# EAGLE design sky293 (EAGLE 4.09)
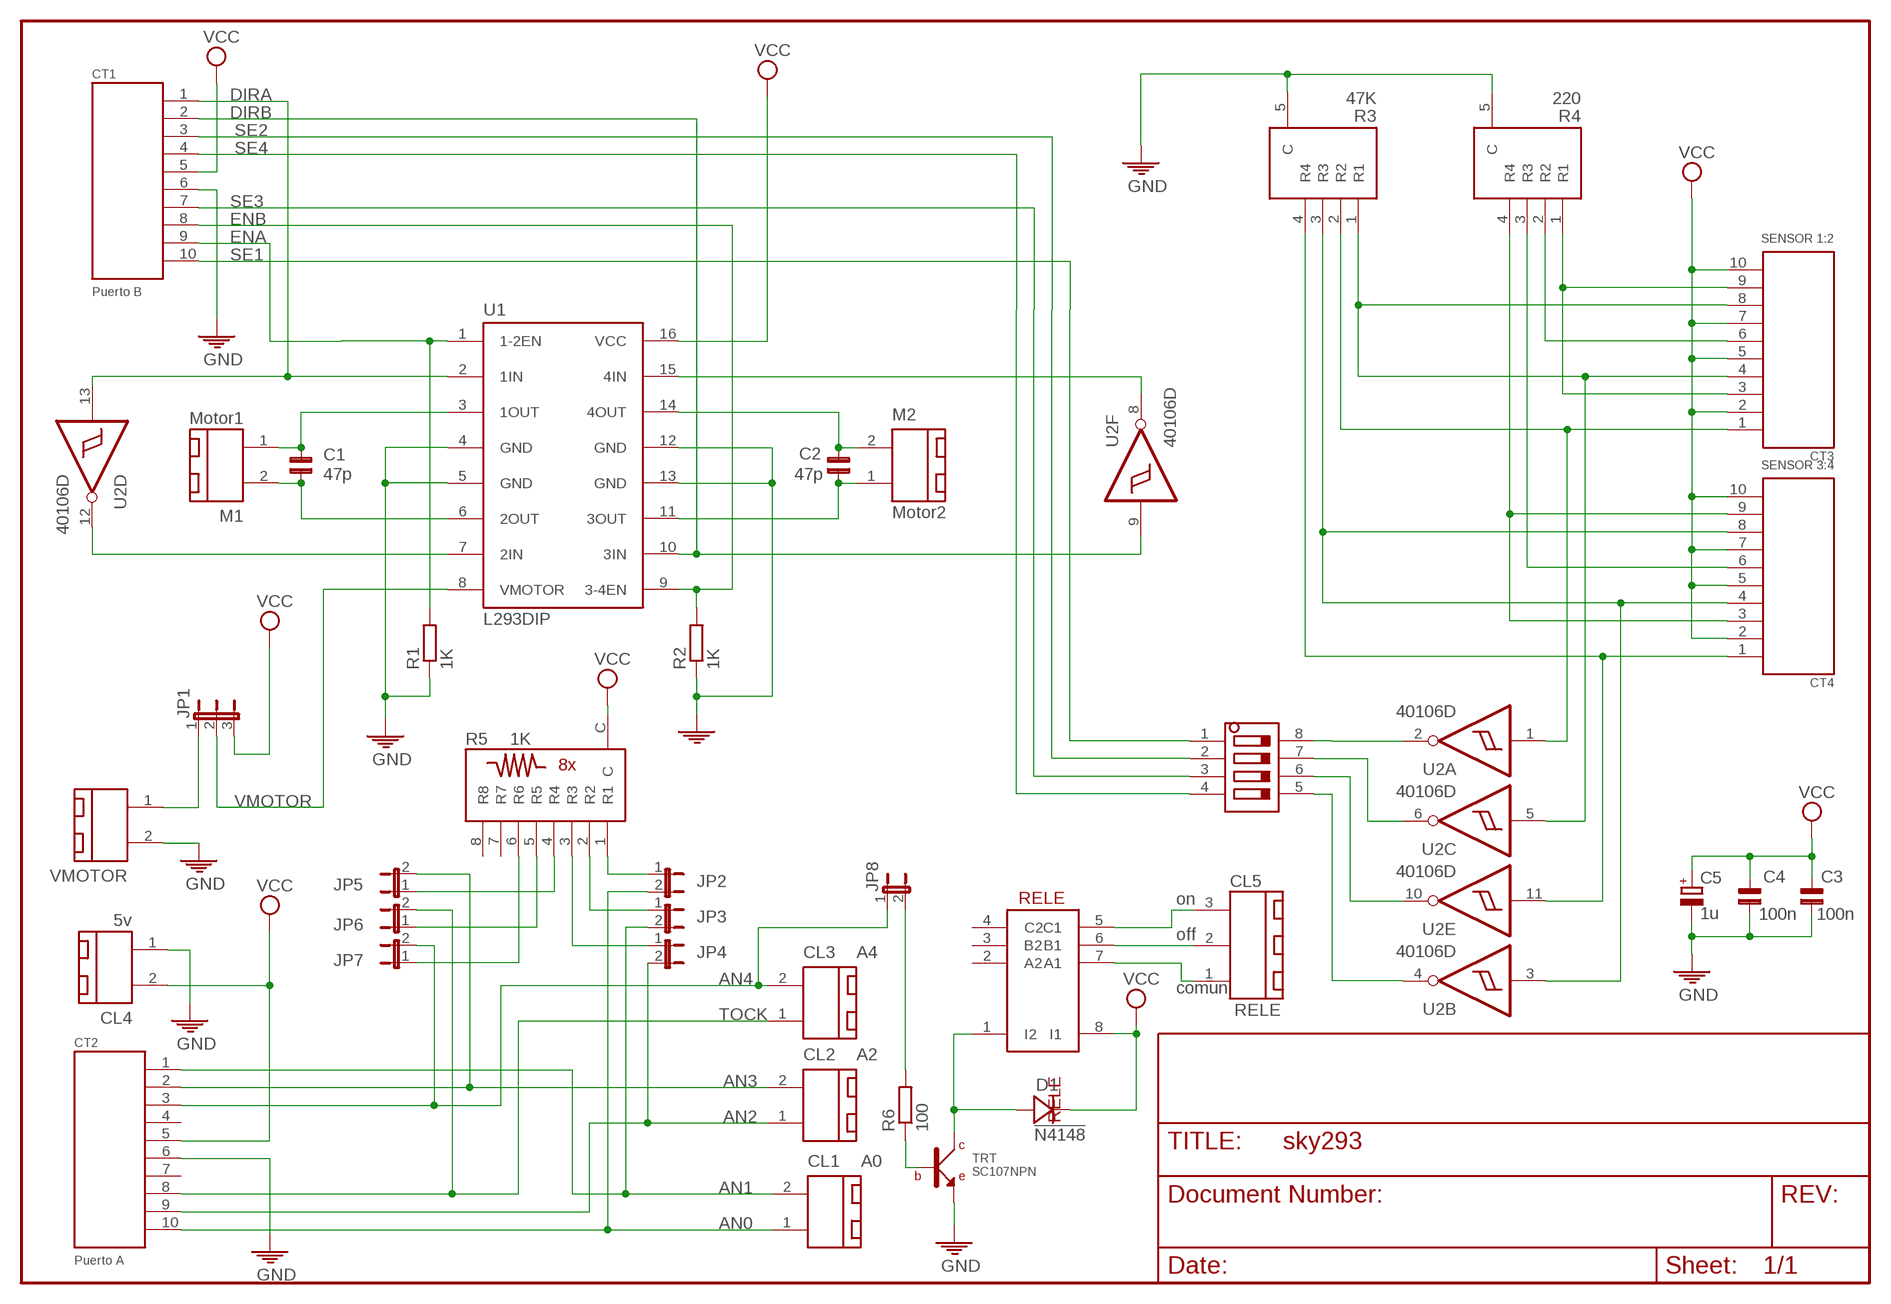
[diagram p0: schematic, sheet 1]

## Parts
C1  47p  CON-MUL5  [C5]
C2  47p  CON-MUL5  [C5]
C3  100n  CON-MUL5  [C5]
C4  100n  CON-MUL5  [C5]
C5  1u  CPOL-EUTT2D6  [TT2D6]
CL1  A0  CLEMA2P  [C2P]
CL2  A2  CLEMA2P  [C2P]
CL3  A4  CLEMA2P  [C2P]
CL4  5v  CLEMA2P  [C2P]
CL5  RELE  CLEMA3P  [C3P]
CT1  Puerto B  CTCONA  [CTCON]
CT2  Puerto A  CTCONA  [CTCON]
CT3  SENSOR 1:2  CTCONA  [CTCON]
CT4  SENSOR 3:4  CTCONA  [CTCON]
D1  !N4148  1N4148  [DIODO]
JP1  JUMPER3R  [JP3R]
JP2  JUMPER2JPR2  [JPR2]
JP3  JUMPER2JPR2  [JPR2]
JP4  JUMPER2JPR2  [JPR2]
JP5  JUMPER2JPR2  [JPR2]
JP6  JUMPER2JPR2  [JPR2]
JP7  JUMPER2JPR2  [JPR2]
JP8  JUMPER2R  [JP2]
M1  Motor1  CLEMA2P  [C2P]
M2  Motor2  CLEMA2P  [C2P]
R1  1K  RESISTENCIA10  [R207/10]
R2  1K  RESISTENCIA10  [R207/10]
R3  47K  ARRAY4  [ARRAY4]
R4  220  ARRAY4  [ARRAY4]
R5  4K7  ARRAY8  [RED8]
R6  100  RESISTENCIA10  [R207/10]
RELE  RELE  [RELE]
TRT  SC107NPN  [TRT-NPN]
U1  L293DIP  [DIL16]
U2  40106D  [DIL14]
U$1  SWITCH4  [SWITCH4]
VMOTOR  CLEMA2P  [C2P]

## Nets
AN0: CL1.1 CT2.10 JP2.2
AN1: CL1.2 CT2.1 JP3.2
AN2: CL2.1 CT2.9 JP4.2
AN3: CL2.2 CT2.2 JP5.2
AN4: CL3.2 CT2.3 JP7.2 JP8.1
DIRA: CT1.1 U1.2(1IN) U2.13(D:I)
DIRB: CT1.2 U1.10(3IN) U2.9(F:I)
ENA: CT1.9 R1.2 U1.1(1-2EN)
ENB: CT1.8 R2.2 U1.9(3-4EN)
GND: C3.1 C4.1 C5.- CL4.1 CT1.6 CT2.6 R1.1 R2.1 R3.5(C) R4.5(C) TRT.E U1.4(GND) U1.5(GND) U1.12(GND) U1.13(GND) VMOTOR.2
N$1: C1.2 M1.1 U1.3(1OUT)
N$2: C1.1 M1.2 U1.6(2OUT)
N$3: C2.2 M2.2 U1.14(4OUT)
N$4: CT3.3 CT3.9 R4.1(R1)
N$5: U2.2(A:O) U$1.8
N$6: U1.7(2IN) U2.12(D:O)
N$7: CT3.6 R4.2(R2)
N$8: U1.15(4IN) U2.8(F:O)
N$9: C2.1 M2.1 U1.11(3OUT)
N$10: JP2.1 R5.1(R1)
N$11: U2.6(C:O) U$1.7
N$12: CT4.3 CT4.9 R4.4(R4)
N$13: U2.10(E:O) U$1.6
N$14: JP1.1 VMOTOR.1
N$15: JP3.1 R5.2(R2)
N$16: U2.4(B:O) U$1.5
N$17: JP4.1 R5.3(R3)
N$18: CT4.6 R4.3(R3)
N$19: CT3.4 CT3.8 R3.1(R1) U2.5(C:I)
N$20: JP5.1 R5.4(R4)
N$21: JP6.1 R5.5(R5)
N$22: CT3.1 R3.2(R2) U2.1(A:I)
N$23: JP7.1 R5.6(R6)
N$24: R6.1 TRT.B
N$25: CL5.3 RELE.5(C1)
N$26: CT4.4 CT4.8 R3.3(R3) U2.3(B:I)
N$27: CL5.2 RELE.6(B1)
N$28: CT4.1 R3.4(R4) U2.11(E:I)
N$29: CL5.1 RELE.7(A1)
N$30: JP8.2 R6.2
N$31: D1.A RELE.1(I2) TRT.C
SE1: CT1.10 U$1.1
SE2: CT1.3 U$1.2
SE3: CT1.7 U$1.3
SE4: CT1.4 U$1.4
TOCK: CL3.1 CT2.8 JP6.2
VCC: C3.2 C4.2 C5.+ CL4.2 CT1.5 CT2.5 CT3.2 CT3.5 CT3.7 CT3.10 CT4.2 CT4.5 CT4.7 CT4.10 D1.K(C) JP1.3 R5.C RELE.8(I1) U1.16(VCC)
VMOTOR: JP1.2 U1.8(VMOTOR)
Unconnected: CT2.4 CT2.7 R5.7(R7) R5.8(R8) RELE.2(A2) RELE.3(B2) RELE.4(C2)

## Notes on the sheet
- R5 | 1K
- on
- off
- comun

## Power pins joined to a net without a drawn wire
GND: U2.7(P:GND)
VCC: U2.14(P:VCC)

## Library data of the parts
C1-C4 = custom-2005:CON-MUL: Condensadores multicapa
C5 = rcl:CPOL-EU: POLARIZED CAPACITOR, European symbol
CL1-CL4 M1 M2 VMOTOR = custom-2005:CLEMA2: Clema doble
CL5 = custom-2005:CLEMA3: clema 3 entradas
CT1-CT4 = custom-2005:CTCON: Conector compatible CT
D1 = custom-2005:1N4148: Diodo
JP1 = custom-2005:JUMPER3: jumper triple
JP2-JP8 = custom-2005:JUMPER2: jumper doble
R1 R2 R6 = custom-2005:RESISTENCIA: Resistencia
R3 R4 = custom-2005:ARRAY4
R5 = custom-2005:ARRAY8
RELE = custom-2005:RELE
TRT = custom-2005:SC107: SC107 y equivalente
U1 = custom-2005:L293: Doble puente en H para control de motores
U2 = custom-2005:40106: Puerta inversora Hex Schmitt Trigger
U$1 = custom-2005:SWITCH4

## Board
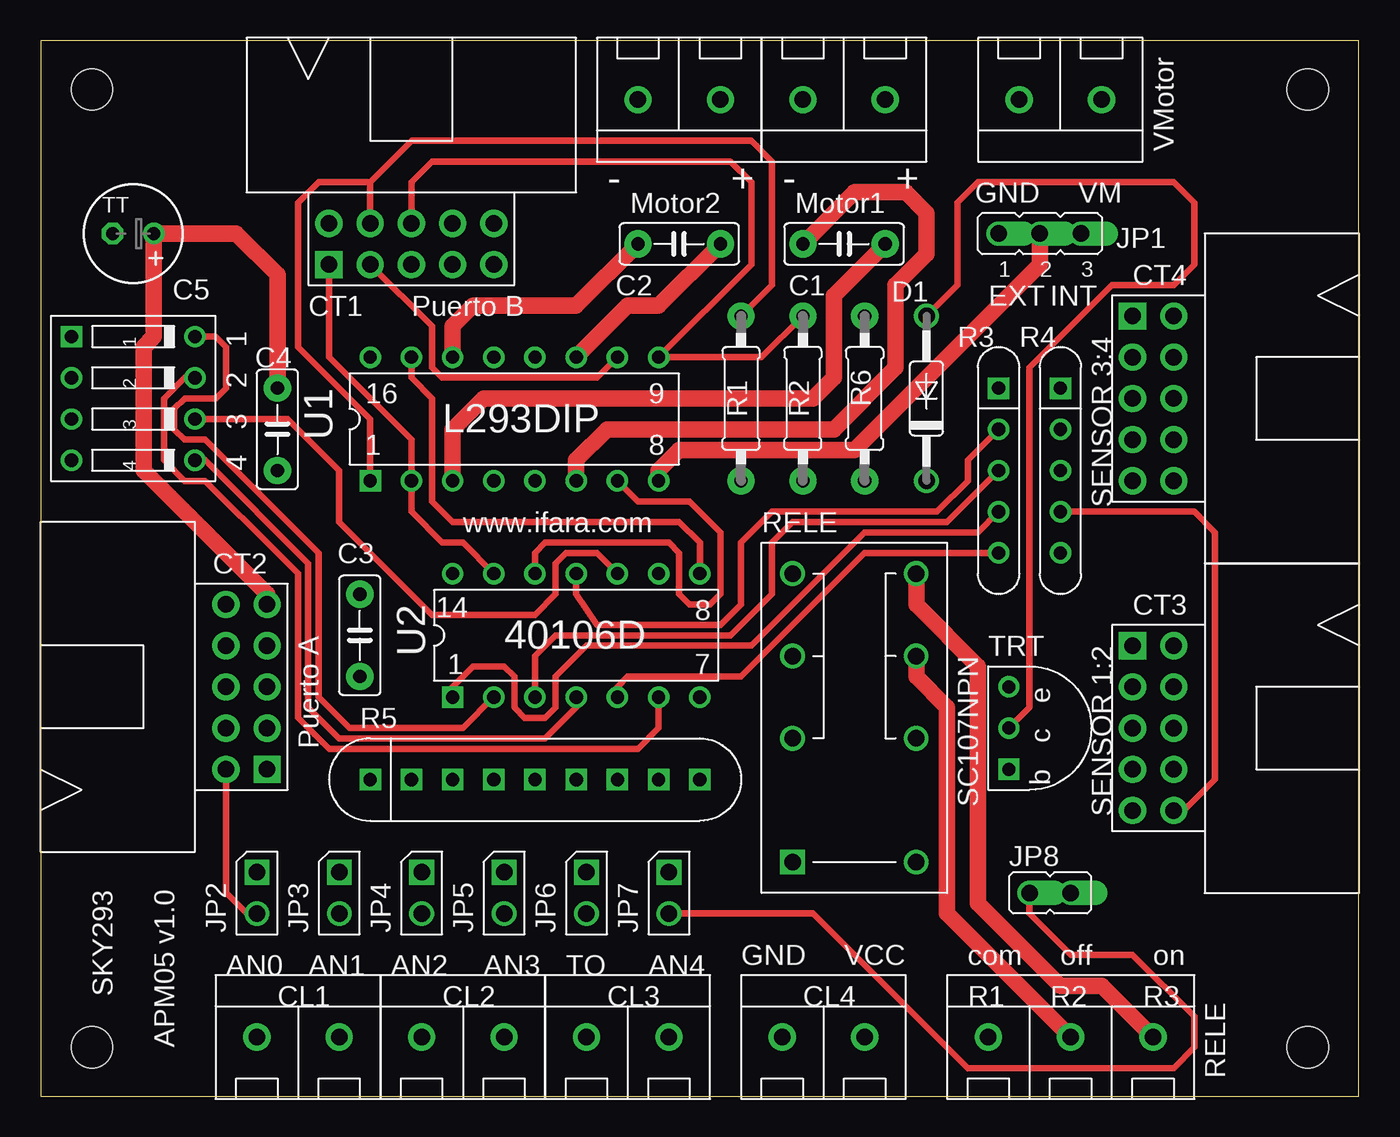
[diagram p1: board, top side]
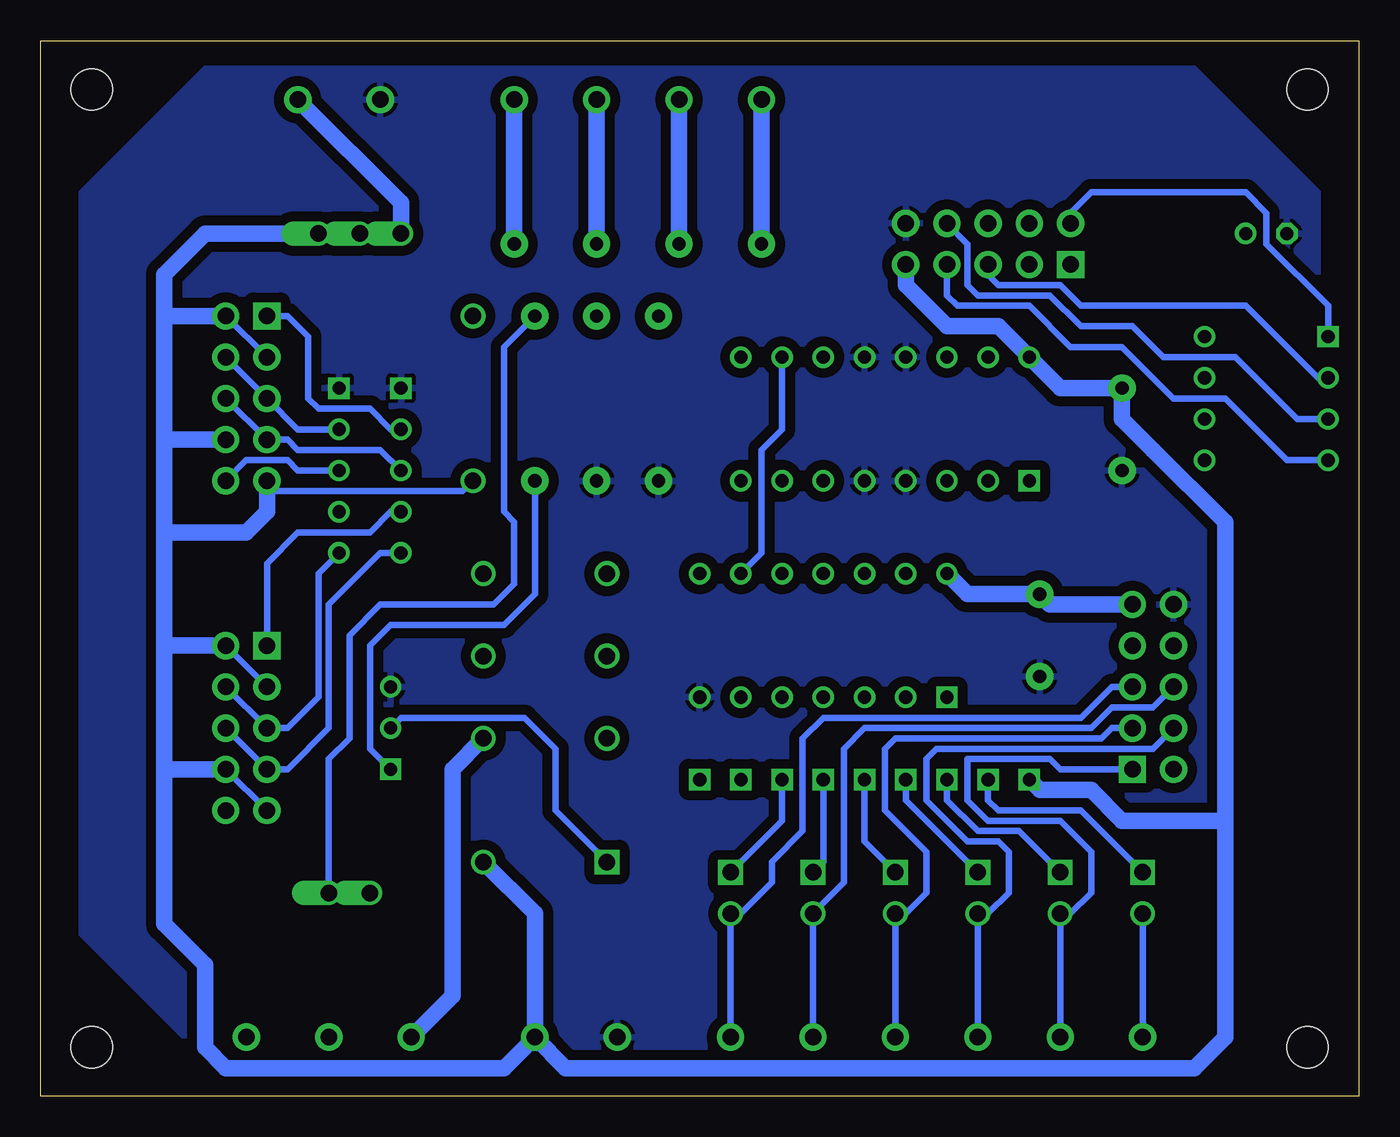
[diagram p2: board, bottom side, seen from below]

Size 81.26 x 65.07 mm. Coordinates in mm from the lower left corner, seen from the top.
Outline: 0,0 81.26,0 81.26,65.07 0,65.07 0,0
Copper layers used: Top, Bottom
Holes 2.54 mm at 3.17,3.01 3.17,62.06 78.1,62.06 78.1,3.01

### Footprints (pad centres in the part's own frame; a part is rotated, then mirrored left to right if it is on the bottom)
C5 = drill 0.813 pad 1.676 round: 1 0,0; 2 5.08,0
TT2D6 = drill 0.813 round: + -1.27,0 | drill 0.813 octagon: - 1.27,0
C2P = drill 1.016 pad 1.676 round: 1 0,0; 2 5.08,0
C3P = drill 1.016 pad 1.676 round: 1 0,0; 2 5.08,0; 3 10.16,0
CTCON = drill 1.016 pad 1.676 square: 1 0,0 | drill 1.016 pad 1.676 round: 2 2.54,0; 3 5.08,0; 4 7.62,0; 5 10.16,0; 6 10.16,2.54; 7 7.62,2.54; 8 5.08,2.54; 9 2.54,2.54; 10 0,2.54
DIODO = drill 1.016 round: A 10.16,0; K 0,0
JP3R = drill 1.016 offset: 1 0,0; 2 2.54,0; 3 5.08,0
JPR2 = drill 1.016 square: 1 0,0 | drill 1.016 round: 2 0,2.54
JP2 = drill 1.016 offset: 1 0,0; 2 2.54,0
R207/10 = drill 0.813 pad 1.676 round: 1 0,0; 2 10.16,0
ARRAY4 = drill 0.813 round: 1 10.16,0; 2 7.62,0; 3 5.08,0; 4 2.54,0 | drill 0.813 square: 5 0,0
RED8 = drill 0.813 square: 1 2.54,0; 2 5.08,0; 3 7.62,0; 4 10.16,0; 5 12.7,0; 6 15.24,0; 7 17.78,0; 8 20.32,0; C 0,0
RELE = drill 1.016 square: 1 0,0 | drill 1.016 round: 2 0,7.62; 3 0,12.7; 4 0,17.78; 5 7.62,17.78; 6 7.62,12.7; 7 7.62,7.62; 8 7.62,0
TRT-NPN = drill 0.813 square: B 1.27,-1.27 | drill 0.813 round: C -1.27,-1.27; E -3.81,-1.27
DIL16 = drill 0.813 square: 1 0,0 | drill 0.813 round: 2 2.54,0; 3 5.08,0; 4 7.62,0; 5 10.16,0; 6 12.7,0; 7 15.24,0; 8 17.78,0; 9 17.78,7.62; 10 15.24,7.62; 11 12.7,7.62; 12 10.16,7.62; 13 7.62,7.62; 14 5.08,7.62; 15 2.54,7.62; 16 0,7.62
DIL14 = drill 0.813 square: 1 0,0 | drill 0.813 round: 2 2.54,0; 3 5.08,0; 4 7.62,0; 5 10.16,0; 6 12.7,0; 7 15.24,0; 8 15.24,7.62; 9 12.7,7.62; 10 10.16,7.62; 11 7.62,7.62; 12 5.08,7.62; 13 2.54,7.62; 14 0,7.62
SWITCH4 = drill 0.813 square: 1 -3.81,-2.54 | drill 0.813 round: 2 -1.27,-2.54; 3 1.27,-2.54; 4 3.81,-2.54; 5 3.81,5.08; 6 1.27,5.08; 7 -1.27,5.08; 8 -3.81,5.08

### Placement (x,y rotation side)
C1  46.98,52.54 0 top
C2  41.9,52.54 180 top
C3  19.68,25.87 90 top
C4  14.6,38.57 90 top
C5  5.71,53.18 180 top
CL1  13.33,3.65 0 top
CL2  23.49,3.65 0 top
CL3  33.65,3.65 0 top
CL4  45.71,3.65 0 top
CL5  58.41,3.65 0 top
CT1  17.78,51.27 0 top
CT2  13.96,20.16 90 top
CT3  67.31,27.78 270 top
CT4  67.31,48.09 270 top
D1  54.6,37.94 90 top
JP1  59.05,53.18 0 top
JP2  13.33,13.81 180 top
JP3  18.41,13.81 180 top
JP4  23.49,13.81 180 top
JP5  28.57,13.81 180 top
JP6  33.65,13.81 180 top
JP7  38.73,13.81 180 top
JP8  60.95,12.54 0 top
M1  52.06,61.43 180 top
M2  41.9,61.43 180 top
R1  43.17,37.94 90 top
R2  46.98,37.94 90 top
R3  59.05,43.65 270 top
R4  62.86,43.65 270 top
R5  20.32,19.52 0 top
R6  50.79,37.94 90 top
RELE  46.35,14.44 0 top
TRT  60.95,21.43 270 top
U1  20.32,37.94 0 top
U2  25.39,24.6 0 top
U$1  4.44,43.02 270 top
VMOTOR  65.4,61.43 180 top

### Tracks (layer width: path | path; a pad name or v marks a point on that pad's centre or on a via)
AN0
  Top 0.406: CT2.10 11.42,12.54 12.69,11.27 JP2.2
  Bottom 0.406: CL1.1 JP2.2
AN1
  Bottom 0.406: CL1.2 JP3.2 17.78,11.27 16.51,12.54 16.51,15.08 18.41,16.98 22.86,16.98 24.12,18.25 24.12,20.79 19.05,20.79 18.41,20.16 CT2.1
AN2
  Bottom 0.406: CL2.1 JP4.2 22.86,11.27 21.59,12.54 21.59,15.08 22.22,15.71 24.12,15.71 26.67,18.25 26.67,20.79 26.03,21.43 12.69,21.43 CT2.9
AN3
  Bottom 0.406: CL2.2 JP5.2 27.94,11.27 26.67,12.54 26.67,15.08 29.21,17.62 29.21,21.43 28.57,22.06 15.87,22.06 15.23,22.7 CT2.2
AN4
  Top 0.406: JP8.1 60.95,11.27 63.49,8.73 67.31,8.73 71.12,4.92 71.12,3.01 69.84,1.74 57.14,1.74 47.62,11.27 JP7.2
  Bottom 0.406: CL3.2 JP7.2 38.09,11.27 36.19,13.17 36.19,14.44 34.28,16.35 34.28,22.06 33.02,23.33 17.14,23.33 15.23,25.23 CT2.3
DIRA
  Top 0.406: CT1.1 17.78,45.55 22.86,40.48 U1.2 22.86,36.03 24.76,34.12 26.03,34.12 U2.13
DIRB
  Top 0.406: CT1.2 24.12,47.46 24.12,44.92 24.76,44.29 34.28,44.29 U1.10
  Bottom 0.406: U1.10 35.55,41.11 36.82,39.84 36.82,33.49 U2.9
ENA
  Top 0.406: R1.2 45.08,50 45.08,57.62 43.81,58.89 22.86,58.89 20.32,56.35 | 20.32,56.35 CT1.9 | U1.1 20.32,41.74 15.87,46.19 15.87,55.08 17.14,56.35 20.32,56.35
ENB
  Top 0.406: R2.2 44.45,45.55 U1.9 43.81,51.27 43.81,56.35 42.54,57.62 24.12,57.62 22.86,56.35 CT1.8
GND
  pour Bottom (isolate 0.61): 2.54,10 2.54,55.72 10.15,63.34 71.12,63.34 78.73,55.72 78.73,10 71.12,2.38 10.15,2.38
N$1
  Top 1.016: U1.3 25.39,41.11 27.3,43.02 47.62,43.02 48.89,44.29 48.89,49.37 C1.2
  Bottom 1.016: C1.2 M1.1
N$2
  Top 1.016: U1.6 33.02,39.2 34.92,41.11 48.89,41.11 52.7,44.92 52.7,50 54.6,51.91 54.6,54.45 53.34,55.72 50.16,55.72 C1.1
  Bottom 1.016: C1.1 M1.2
N$3
  Top 1.016: U1.14 25.39,47.46 26.67,48.73 33.02,48.73 C2.2
  Bottom 1.016: C2.2 M2.2
N$4
  Bottom 0.406: CT3.9 CT3.3 66.04,22.7 64.13,24.6 64.13,32.22 R4.1
N$5
  Top 0.406: U$1.8 10.79,46.83 11.42,46.19 11.42,43.65 10.79,43.02 8.88,43.02 8.25,42.38 8.25,41.11 8.88,40.48 10.15,40.48 13.96,36.66 17.14,33.49 17.14,24.6 19.05,22.7 26.03,22.7 U2.2
N$6
  Top 0.406: U2.12 30.48,33.49 31.11,34.12 32.38,34.12 38.73,34.12 39.36,33.49 39.36,30.95 40,30.32 41.27,30.32 41.9,30.95 41.9,34.76 40,36.66 36.82,36.66 U1.7
N$7
  Top 0.406: R4.2 71.12,36.03 72.39,34.76 72.39,19.52 70.48,17.62 CT3.6
N$8
  Top 0.406: U1.15 22.86,44.29 24.12,43.02 24.12,36.66 25.39,35.4 37.46,35.4 39.36,35.4 40.63,34.12 U2.8
N$9
  Top 1.016: U1.11 36.19,48.73 38.09,48.73 C2.1
  Bottom 1.016: C2.1 M2.1
N$10
  Bottom 0.406: R5.1 22.86,18.25 22.22,17.62 17.14,17.62 JP2.1
N$11
  Top 0.406: U2.6 38.09,22.7 36.82,21.43 17.78,21.43 15.87,23.33 15.87,32.22 14.6,33.49 10.15,37.94 8.88,37.94 7.62,39.2 7.62,43.02 8.88,44.29 U$1.7
N$12
  Bottom 0.406: CT4.9 CT4.3 65.4,41.11 R4.4
N$13
  Top 0.406: U2.10 34.28,33.49 32.38,33.49 31.75,32.86 31.75,30.95 30.48,29.68 29.84,29.68 24.12,29.68 18.41,35.4 18.41,38.57 15.23,41.74 U$1.6
N$14
  Bottom 1.016: JP1.1 59.05,55.08 VMOTOR.1
N$15
  Bottom 0.406: R5.2 25.39,18.25 23.49,16.35 20.95,16.35 JP3.1
N$16
  Top 0.406: U$1.5 10.15,39.2 16.51,32.86 16.51,23.96 18.41,22.06 31.11,22.06 33.02,23.96 U2.4
N$17
  Bottom 0.406: R5.3 27.94,18.25 JP4.1
N$18
  Bottom 0.406: R4.3 65.4,38.57 66.04,39.2 68.58,39.2 CT4.6
N$19
  Top 0.406: U2.5 35.55,25.23 36.19,25.87 43.17,25.87 50.79,33.49 52.7,33.49 R3.1
  Bottom 0.406: CT3.8 CT3.4 66.04,20.16 63.49,22.7 63.49,30.32 60.32,33.49 R3.1
N$20
  Bottom 0.406: R5.4 30.48,15.71 JP5.1
N$21
  Bottom 0.406: R5.5 33.02,14.44 JP6.1
N$22
  Top 0.406: U2.1 25.39,25.23 26.67,26.51 28.57,26.51 29.21,25.87 29.21,23.96 29.84,23.33 31.11,23.33 31.75,23.96 31.75,25.87 33.65,27.78 43.81,27.78 50.79,34.76 57.78,34.76 R3.2
  Bottom 0.406: R3.2 59.68,36.03 60.95,34.76 65.4,34.76 67.31,32.86 CT3.1
N$23
  Bottom 0.406: R5.6 35.55,16.98 JP7.1
N$24
  Bottom 0.406: R6.1 50.79,30.95 52.7,29.05 59.68,29.05 60.95,27.78 60.95,21.43 TRT.B
N$25
  Top 1.016: RELE.5 53.97,30.32 57.78,26.51 57.78,11.9 62.86,6.82 65.4,6.82 CL5.3
N$26
  Top 0.406: U2.3 30.48,27.14 31.75,28.41 34.28,28.41 42.54,28.41 45.08,30.95 45.08,34.12 46.35,35.4 55.88,35.4 R3.3
  Bottom 0.406: CT4.8 CT4.4 66.04,40.48 65.4,39.84 60.32,39.84 R3.3
N$27
  Top 1.016: RELE.6 53.97,25.87 55.88,23.96 55.88,11.27 CL5.2
N$28
  Top 0.406: U2.11 33.02,30.95 34.28,29.05 41.9,29.05 43.17,30.32 43.17,34.12 45.08,36.03 55.24,36.03 57.14,37.94 57.14,39.2 R3.4
  Bottom 0.406: R3.4 59.68,41.11 60.95,42.38 64.13,42.38 64.77,43.02 64.77,46.83 66.04,48.09 CT4.1
N$29
  Bottom 1.016: RELE.7 55.88,20.16 55.88,6.82 55.88,6.18 CL5.1
N$30
  Bottom 0.406: JP8.2 63.49,20.79 62.22,22.06 62.22,28.41 60.32,30.32 53.34,30.32 52.06,31.59 52.06,35.4 52.7,36.03 52.7,46.19 R6.2
N$31
  Top 0.406: D1.A 56.51,50 56.51,55.08 57.78,56.35 69.84,56.35 71.12,55.08 71.12,51.27 69.84,50 66.04,50 60.95,44.92 60.95,23.96 TRT.C
  Bottom 0.406: TRT.C 59.05,23.33 51.43,23.33 49.52,21.43 49.52,17.62 RELE.1
SE1
  Bottom 0.406: CT1.10 17.78,54.45 16.51,55.72 6.98,55.72 5.71,54.45 5.71,52.54 1.9,48.73 U$1.1
SE2
  Bottom 0.406: U$1.2 2.54,44.29 3.81,45.55 6.98,48.73 17.14,48.73 18.41,50 22.22,50 22.86,50.63 CT1.3
SE3
  Bottom 0.406: U$1.3 3.81,41.74 7.62,45.55 12.06,45.55 13.96,47.46 17.14,47.46 19.05,49.37 23.49,49.37 24.12,50 24.12,52.54 CT1.7
SE4
  Bottom 0.406: CT1.4 25.39,49.37 24.76,48.73 20.32,48.73 17.78,46.19 14.6,46.19 11.42,43.02 8.25,43.02 4.44,39.2 U$1.4
TOCK
  Bottom 0.406: CL3.1 JP6.2 31.75,13.17 31.75,21.43 30.48,22.7 16.51,22.7 15.23,23.96 12.69,23.96 CT2.8
VCC
  Top 1.016: C4.2 14.6,50.63 12.06,53.18 C5.+ 6.98,46.83 6.34,46.19 6.34,38.57 13.96,30.95 CT2.5
  Bottom 0.406: CT3.10 CT3.2 | CT3.7 CT3.5 | CT4.10 CT4.2 | CT4.5 66.67,37.3 55.24,37.3 D1.K
  Bottom 1.016: CL4.2 50.79,11.27 RELE.8 | CL4.2 52.7,1.74 69.84,1.74 71.12,3.01 71.12,8.09 73.66,10.63 73.66,20.16 | 73.66,20.16 CT3.7 | 73.66,20.16 73.66,27.78 | 73.66,27.78 73.66,34.76 | 73.66,34.76 73.66,40.48 | 73.66,40.48 73.66,48.09 | 73.66,48.09 73.66,50.63 71.12,53.18 JP1.3 | 73.66,48.09 CT4.10 | 73.66,40.48 CT4.7 | 73.66,27.78 CT3.10 | U2.14 24.12,30.95 C3.2 19.05,30.32 CT2.5 | CT1.5 27.94,50 25.39,47.46 22.22,47.46 U1.16 18.41,43.65 C4.2 14.6,41.74 12.69,39.84 8.25,35.4 8.25,34.76 8.25,16.98 | R5.C 19.68,18.89 16.51,18.89 14.6,16.98 8.25,16.98 | 8.25,16.98 8.25,3.65 10.15,1.74 48.89,1.74 CL4.2 | CT4.5 67.31,36.03 68.58,34.76 73.66,34.76
VMOTOR
  Top 1.016: U1.8 38.09,38.57 39.36,39.84 50.16,39.84 61.59,51.27 JP1.2

### Text on the board
tPlace: VMotor | GND | VM | - | Motor2 | + | - | Motor1 | + | EXT | INT | 1 | 2 | 3 | 4 | www.ifara.com | R5 | AN0 | AN1 | AN2 | AN3 | TO | AN4 | GND | VCC | com | off | on | SKY293 | CL1 | CL2 | CL3 | CL4 | R1 | R2 | R3 | APM05 v1.0